# EAGLE design counter_defender_mk_3 (EAGLE 6.5.0)
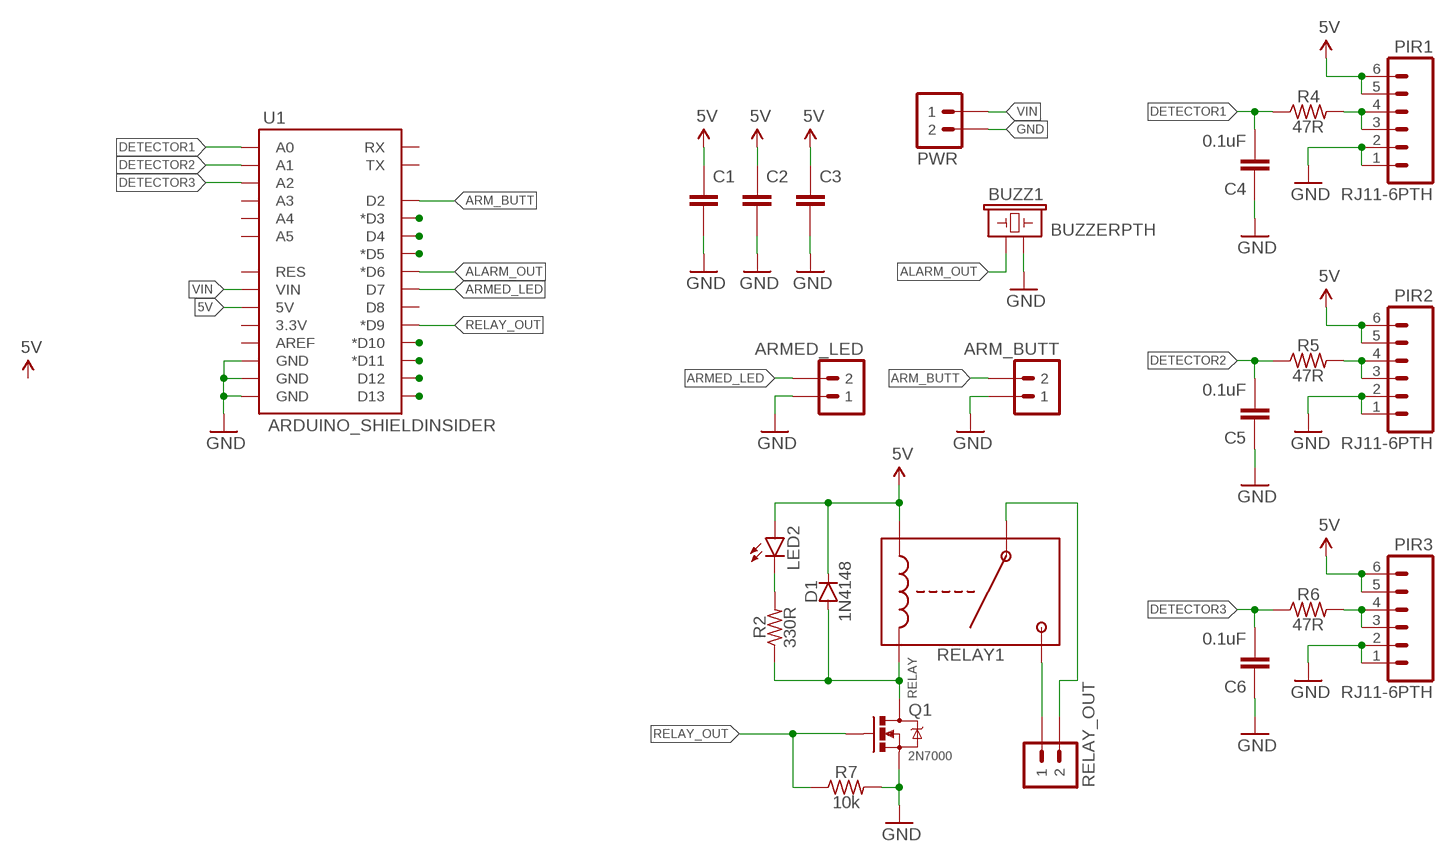
[diagram p0: schematic, sheet 1]

## Parts
ARM_BUTT  M02JST-PTH-VERT  [JST-2-PH-VERT-PTH]
ARMED_LED  M02JST-PTH-VERT  [JST-2-PH-VERT-PTH]
BUZZ1  BUZZERPTH  [BUZZER-12MM]
C1  CAPACITOR-CERAMIC025-024X044  [C025-024X044]
C2  CAPACITOR-CERAMIC025-024X044  [C025-024X044]
C3  CAPACITOR-CERAMIC025-024X044  [C025-024X044]
C4  0.1uF  CAPACITOR-CERAMIC025-024X044  [C025-024X044]
C5  0.1uF  CAPACITOR-CERAMIC025-024X044  [C025-024X044]
C6  0.1uF  CAPACITOR-CERAMIC025-024X044  [C025-024X044]
D1  1N4148  DIODEPTH-7.62MM  [DIODE-7.62MM]
LED2  LED3MM  [LED3MM]
PIR1  RJ11-6PTH  [RJ11-6]
PIR2  RJ11-6PTH  [RJ11-6]
PIR3  RJ11-6PTH  [RJ11-6]
PWR  M02JST-PTH-VERT  [JST-2-PH-VERT-PTH]
Q1  2N7000  MOSFET-NCHANNEL2N7000-AMMO  [TO-92-AMMO]
R2  330R  RESISTORPTH-AXIAL-7.62MM  [RESISTOR-AXIAL-PTH-7.62MM]
R4  47R  RESISTORPTH-AXIAL-6.35MM  [RESISTOR-AXIAL-PTH-6.35MM]
R5  47R  RESISTORPTH-AXIAL-6.35MM  [RESISTOR-AXIAL-PTH-6.35MM]
R6  47R  RESISTORPTH-AXIAL-6.35MM  [RESISTOR-AXIAL-PTH-6.35MM]
R7  10k  RESISTORPTH-AXIAL-7.62MM  [RESISTOR-AXIAL-PTH-7.62MM]
RELAY1  RELAY-SPST-NOT77  [T77-SPST-NO-RELAY]
RELAY_OUT  M02SCREWTERM_2.54MM  [1X02_2.54_SCREWTERM]
U1  ARDUINO_SHIELDINSIDER  [ARDUINO_SHIELD_NOOUTLINE_INSIDE]

## Nets
5V: C1.1 C2.1 C3.1 D1.K(C) LED2.A PIR1.5 PIR1.6 PIR2.5 PIR2.6 PIR3.5 PIR3.6 RELAY1.COIL2(C$2) U1.5V
ALARM_OUT: BUZZ1.+ U1.D6(*D6)
ARM_BUTT: ARM_BUTT.2 U1.D2
ARMED_LED: ARMED_LED.2 U1.D7
DETECTOR1: C4.2 R4.P$1 U1.A0
DETECTOR2: C5.2 R5.P$1 U1.A1
DETECTOR3: C6.2 R6.P$1 U1.A2
GND: ARM_BUTT.1 ARMED_LED.1 BUZZ1.- C1.2 C2.2 C3.2 C4.1 C5.1 C6.1 PIR1.1 PIR1.2 PIR2.1 PIR2.2 PIR3.1 PIR3.2 PWR.2 Q1.1(S) R7.P$2 U1.GND@0(GND) U1.GND@1(GND) U1.GND@2(GND)
N$2: PIR1.3 PIR1.4 R4.P$2
N$3: PIR2.3 PIR2.4 R5.P$2
N$4: PIR3.3 PIR3.4 R6.P$2
N$6: U1.D13
N$7: U1.D12
N$8: LED2.K(C) R2.P$2
N$9: U1.D11(*D11)
N$10: RELAY1.NO RELAY_OUT.P1
N$11: U1.D10(*D10)
N$12: U1.D5(*D5)
N$13: U1.D4
N$14: U1.D3(*D3)
N$17: RELAY1.COM RELAY_OUT.P2
RELAY: D1.A Q1.3(D) R2.P$1 RELAY1.COIL1(C$1)
RELAY_OUT: Q1.2(G) R7.P$1 U1.D9(*D9)
VIN: PWR.1 U1.VIN
Unconnected: U1.3.3V U1.A3 U1.A4 U1.A5 U1.AREF U1.D8 U1.RES U1.RX U1.TX

## Library data of the parts
ARM_BUTT ARMED_LED PWR RELAY_OUT = A_butts:M02: Standard 2-pin 0.1" header. Use with - straight break away headers ( PRT-00116) - right angle break away headers (PRT-00553) - swiss pins (PRT-00743) - machine pins (PRT-00117) - female headers (PRT-00115) Molex polarized connector foot print use with: PRT-08233 with associated crimp pins and housings. 2.54_SCREWTERM for use with PRT-10571. 3.5mm Screw Terminal footprints for PRT-08084 5mm Screw Terminal footprints for use with PRT-08433
BUZZ1 = A_butts:BUZZER: Buzzer 12mm Spark Fun Electronics SKU : Comp-Buzzer
C1-C6 = A_butts:CAPACITOR-CERAMIC: CAPACITOR, European symbol
D1 = A_butts:DIODE: Diode These are standard reverse protection diodes and small signal diodes. SMA package can handle up to about 1A. SOD-323 can handle about 200mA. What the SOD-323 package when ordering, there are some mfgs out there that are 5-pin packages.
LED2 = A_butts:LED: LEDs Standard schematic elements and footprints for 5mm, 3mm, 1206, and 0603 sized LEDs. 5mm - Spark Fun Electronics SKU : COM-00529 (and others)
PIR1-PIR3 = A_butts:RJ11-6: RJ11 Jack Simple 6 pin RJ11 jack. Commonly found on CAT3 devices and Microchip programmers. SKU: PRT-00132
Q1 = A_butts:MOSFET-NCHANNEL: Common NMOSFET Parts MFG P/N Store ID Prod ID FDD8780 TRANS-09984 SI7820DN TRANS-11055 FDS6630A IC-08089 2N7002PW TRANS-11151 FQP30N06L COM-10213 TRANS-10060 BSS123LT1G TRANS-08345 BSS138 TRANS-00830 BS170 2N7000
R2 R4-R7 = A_butts:RESISTOR: RESISTOR, American symbol
RELAY1 = A_butts:RELAY-SPST-NO
U1 = A_butts:ARDUINO_SHIELD: Arduino shield footprint

## Board
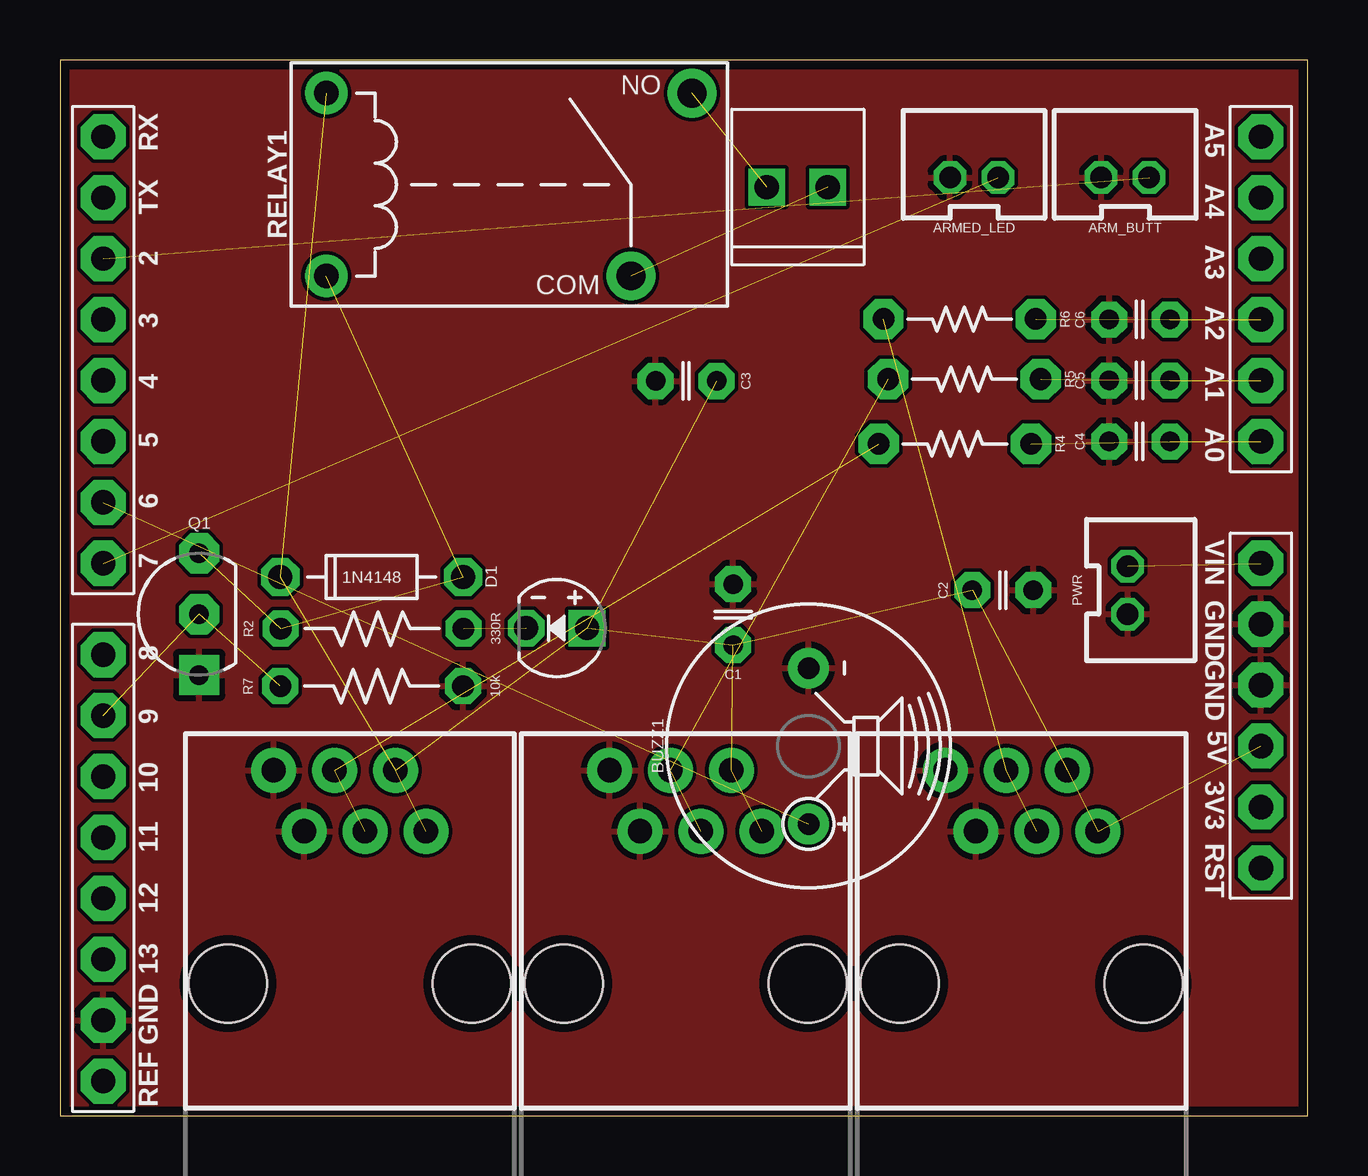
[diagram p1: board, top side]

Size 52 x 44 mm. Coordinates in mm from the lower left corner, seen from the top.
Outline: 0,0 52,0 52,44 0,44 0,0
Copper layers (1*16): Top 0.0356mm / dielectric 1.5011mm / Bottom 0.0356mm
Design rules "LaenPCBOrder2": minimum track width 6mil, minimum drill 13mil, track to track 6mil, track to pad 6mil, pad to pad 6mil, via to via 6mil, smd to smd 6mil, copper to edge 15mil, drill to drill 6mil, minimum pad ring 7mil, minimum via ring 7mil, stop-mask expansion 3mil, vias tented up to drill 20mil, thermal gap 10mil

### Footprints (pad centres in the part's own frame; a part is rotated, then mirrored left to right if it is on the bottom)
JST-2-PH-VERT-PTH = drill 0.9 octagon: 1 -1,0; 2 1,0
BUZZER-12MM = drill 0.9 pad 1.7: + 3.25,0; - -3.25,0
C025-024X044 = drill 0.813 pad 1.5 octagon: 1 -1.27,0; 2 1.27,0
DIODE-7.62MM = drill 1 pad 1.6 octagon: A -3.81,0; K 3.81,0
LED3MM = drill 1 pad 1.524 square: A -1.27,0 | drill 1 pad 1.524 octagon: K 1.27,0
RJ11-6 = drill 1.016 pad 1.88: 1 1.905,8.89; 2 3.175,6.35; 3 4.445,8.89; 4 5.715,6.35; 5 6.985,8.89; 6 8.255,6.35 | hole 3.251: 0,0; 10.16,0
TO-92-AMMO = drill 0.813 pad 1.676 square: 1 -2.54,0 | drill 0.813 pad 1.676 octagon: 2 0,0; 3 2.54,0
RESISTOR-AXIAL-PTH-7.62MM = drill 0.9 pad 1.5 octagon: P$1 -3.81,0; P$2 3.81,0
RESISTOR-AXIAL-PTH-6.35MM = drill 0.9 pad 1.676 octagon: P$1 -3.175,0; P$2 3.175,0
T77-SPST-NO-RELAY = drill 1.016 pad 1.778: COIL1 0,0; COIL2 0,7.62 | drill 1.2 pad 2.032: COM 12.7,0; NO 15.24,7.62
1X02_2.54_SCREWTERM = drill 1.016 square: P1 2.54,0; P2 0,0
ARDUINO_SHIELD_NOOUTLINE_INSIDE = drill 1.016 pad 1.88 octagon: 3.3V 48.26,-27.94; 5V 48.26,-25.4; A0 48.26,-12.7; A1 48.26,-10.16; A2 48.26,-7.62; A3 48.26,-5.08; A4 48.26,-2.54; A5 48.26,0; AREF 0,-39.37; D2 0,-5.08; D3 0,-7.62; D4 0,-10.16; D5 0,-12.7; D6 0,-15.24; D7 0,-17.78; D8 0,-21.59; D9 0,-24.13; D10 0,-26.67; D11 0,-29.21; D12 0,-31.75; D13 0,-34.29; GND@0 48.26,-22.86; GND@1 48.26,-20.32; GND@2 0,-36.83; RES 48.26,-30.48; RX 0,0; TX 0,-2.54; VIN 48.26,-17.78

### Placement (x,y rotation side)
ARM_BUTT  44.4,39.1 0 top
ARMED_LED  38.1,39.1 0 top
BUZZ1  31.2,15.4 270 top
C1  28.06,20.88 90 top
C2  39.3,21.9 0 top
C3  26.1,30.62 180 top
C4  45,28.1 0 top
C5  45,30.64 0 top
C6  45,33.18 0 top
D1  12.99,22.45 180 top
LED2  20.7,20.32 180 top
PIR1  7,5.5 0 top
PIR2  21,5.5 0 top
PIR3  35,5.5 0 top
PWR  44.5,21.9 270 top
Q1  5.8,20.9 90 top
R2  13.01,20.3 0 top
R4  37.3,28 180 top
R5  37.7,30.7 180 top
R6  37.5,33.2 180 top
R7  12.99,17.9 0 top
RELAY1  11.1,35 0 top
RELAY_OUT  32,38.7 180 top
U1  1.8,40.8 0 top

### Tracks (layer width: path | path; a pad name or v marks a point on that pad's centre or on a via)
5V  (12 unrouted)
ALARM_OUT  (1 unrouted)
ARM_BUTT  (1 unrouted)
ARMED_LED  (1 unrouted)
DETECTOR1  (2 unrouted)
DETECTOR2  (2 unrouted)
DETECTOR3  (2 unrouted)
GND
  pour Top: 0,0 0,44 52,44 52,0
N$2  (2 unrouted)
N$3  (2 unrouted)
N$4  (2 unrouted)
N$8  (1 unrouted)
N$10  (1 unrouted)
N$17  (1 unrouted)
RELAY  (3 unrouted)
RELAY_OUT  (2 unrouted)
VIN  (1 unrouted)